# Altium schematic sheet RF.SchDoc
size A
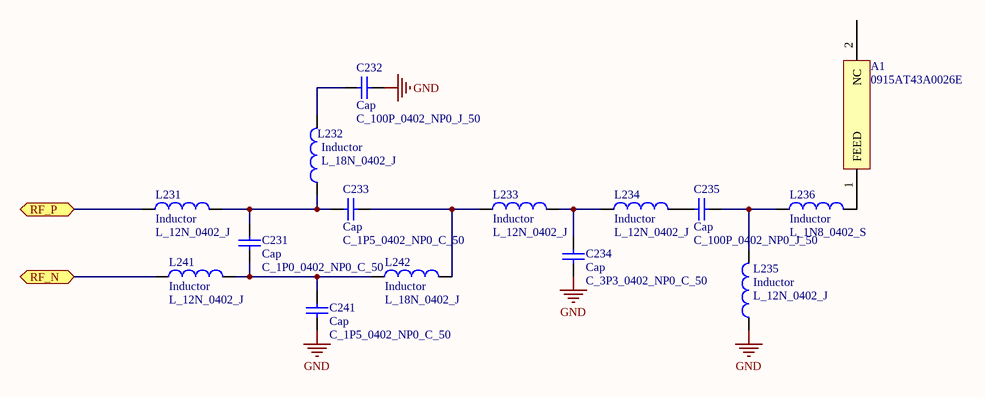
[diagram p0: RF.SchDoc]

## Parts
A1  0915AT43A0026E  [0915AT43A0026]
C231  Cap  value C_1P0_0402_NP0_C_50  [C_0402]
C232  Cap  value C_100P_0402_NP0_J_50  [C_0402]
C233  Cap  value C_1P5_0402_NP0_C_50  [C_0402]
C234  Cap  value C_3P3_0402_NP0_C_50  [C_0402]
C235  Cap  value C_100P_0402_NP0_J_50  [C_0402]
C241  Cap  value C_1P5_0402_NP0_C_50  [C_0402]
L231  Inductor  value L_12N_0402_J  [R_0402]
L232  Inductor  value L_18N_0402_J  [R_0402]
L233  Inductor  value L_12N_0402_J  [R_0402]
L234  Inductor  value L_12N_0402_J  [R_0402]
L235  Inductor  value L_12N_0402_J  [R_0402]
L236  Inductor  value L_1N8_0402_S  [R_0402]
L241  Inductor  value L_12N_0402_J
L242  Inductor  value L_18N_0402_J  [R_0402]

## Ports
RF_N, RF_P

## Nets
GND: C232.2 C234.1 C241.1 L235.1
RF_N: L241.1 ; port RF_N
RF_P: L231.1 ; port RF_P
NetA1_1: A1.1(FEED) L236.2
NetC231_1: C231.1 C241.2 L241.2 L242.1
NetC231_2: C231.2 C233.1 L231.2 L232.1
NetC232_1: C232.1 L232.2
NetC233_2: C233.2 L233.1 L242.2
NetC234_2: C234.2 L233.2 L234.1
NetC235_1: C235.1 L234.2
NetC235_2: C235.2 L235.2 L236.1

Not connected (* = marked no-connect by the designer): A1 2(NC)

## Library data of the parts
A1 = 0915AT43A0026E: RF CHIP ANTENNA 902 - 928MHZ; Manufacturer: Johanson Technology Inc; Number of Bands: 1; Frequency: 902MHz ~ 928MHz; Gain: -1dBi; Supplier 1: Digi-Key; Manufacturer Part Number: 0915AT43A0026E; RoHS: RoHS Compliant; Category: RF/IF and RFID; Stock 1: 832; Pricing 1: 1=1.22, 10=1.022, 25=0.8808, 50=0.8266, 100=0.6525, 250=0.54376, 500=0.48938 (USD); Antenna Type: Chip; VSWR: -; Termination: Surface Mount; Mounting Type: Surface Mount; Height (Max): -; Packaging: Cut Tape (CT); Supplier Part Number 1: 712-1535-1-ND
C231-C235 C241 = Cap: Capacitor; Published: 8-Jun-2000; LatestRevisionDate: 17-Jul-2002; LatestRevisionNote: Re-released for DXP Platform.; Publisher: Altium Limited; Supplier 1: Digi-Key
  C231: Supplier Part Number 1: 490-3199-1-ND; Supplier 2: Mouser; Supplier Part Number 2: 81-GRM1555C1H1R0CZ01
  C232 C235: Supplier Part Number 1: 490-3458-1-ND
  C233 C241: Supplier Part Number 1: 490-1266-1-ND; Supplier 2: Mouser; Supplier Part Number 2: 81-GRM36C1R5C50
  C234: Supplier Part Number 1: 490-1270-1-ND; Supplier 2: Mouser; Supplier Part Number 2: 81-GRM36C3R3C50
L231-L236 L241 L242 = Inductor: Code_IEC: 1005; Published: 8-Jun-2000; LatestRevisionDate: 29-May-2009; LatestRevisionNote: IPC-7351 Footprint Added.; PackageReference: 0402-A; Publisher: Altium Limited; PackageDescription: Chip Inductor; Code_JEITA: 0402; Supplier 1: Digi-Key; Supplier 2: Mouser
  L231 L233-L235 L241: Supplier Part Number 1: 490-2624-1-ND; Supplier Part Number 2: 81-LQG15HS12NJ02D
  L232 L242: Supplier Part Number 1: 490-2626-1-ND; Supplier Part Number 2: 81-LQG15HS18NJ02D
  L236: Supplier Part Number 1: 490-1127-1-ND; Supplier Part Number 2: 81-LQP15MN1N8B02D